# EAGLE schematic ads1298schield (EAGLE 7.2.0)

## Sheet 1 of 4
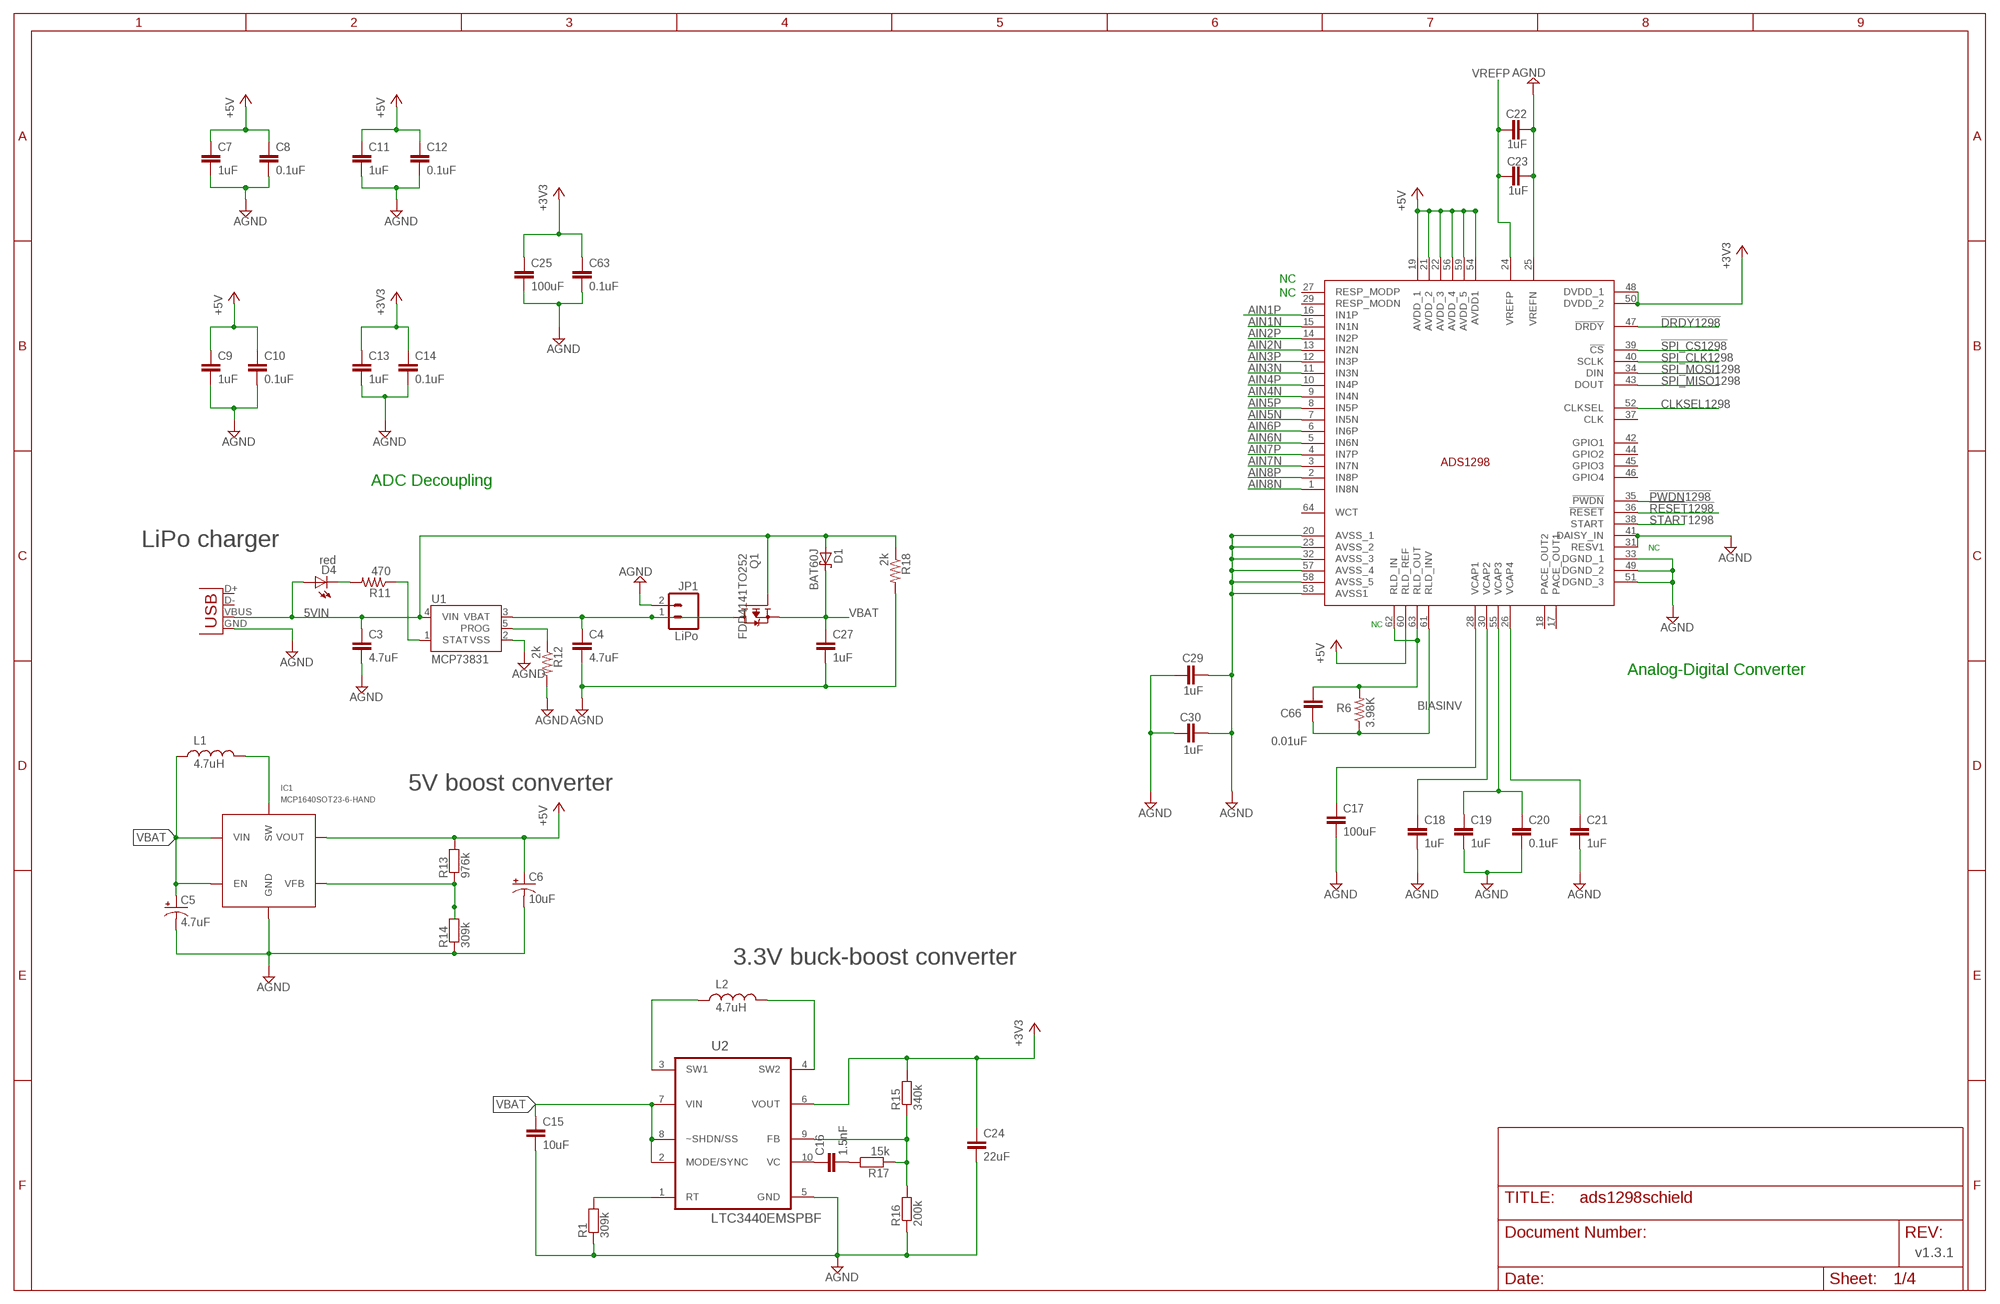
[diagram p0: schematic, sheet 1]

### Parts
C3  4.7uF  CAP0402-CAP  [0402-CAP]
C4  4.7uF  CAP0402-CAP  [0402-CAP]
C5  4.7uF  CAP_POL1206  [EIA3216]
C6  10uF  CAP_POL1206  [EIA3216]
C7  1uF  CAP0603-CAP  [0603-CAP]
C8  0.1uF  CAP0603-CAP  [0603-CAP]
C9  1uF  CAP0603-CAP  [0603-CAP]
C10  0.1uF  CAP0603-CAP  [0603-CAP]
C11  1uF  CAP0603-CAP  [0603-CAP]
C12  0.1uF  CAP0603-CAP  [0603-CAP]
C13  1uF  CAP0603-CAP  [0603-CAP]
C14  0.1uF  CAP0603-CAP  [0603-CAP]
C15  10uF  CAP1210  [1210]
C16  1.5nF  CAP1210  [1210]
C17  100uF  CAP1210  [1210]
C18  1uF  CAP0603-CAP  [0603-CAP]
C19  1uF  CAP0603-CAP  [0603-CAP]
C20  0.1uF  CAP0603-CAP  [0603-CAP]
C21  1uF  CAP0603-CAP  [0603-CAP]
C22  1uF  CAP0603-CAP  [0603-CAP]
C23  1uF  CAP0603-CAP  [0603-CAP]
C24  22uF  CAP1210  [1210]
C25  100uF  CAP1210  [1210]
C27  1uF  CAP0402-CAP  [0402-CAP]
C29  1uF  CAP0603-CAP  [0603-CAP]
C30  1uF  CAP0603-CAP  [0603-CAP]
C63  0.1uF  CAP0603-CAP  [0603-CAP]
C66  0.01uF  CAP0603-CAP  [0603-CAP]
D1  BAT60J  [SOD323_ST]
D4  red  LED0603  [LED-0603]
IC1  MCP1640SOT23-6-HAND  [SOT23-6-HAND]
JP1  LiPo  M02-JST-2MM-SMT  [JST-2-SMD]
L1  4.7uH  INDUCTOR1210-HAND  [1210-HAND]
L2  4.7uH  INDUCTOR1210-HAND  [1210-HAND]
Q1  FDD4141TO252  [TO252]
R1  309k  RESISTOR1206-HAND  [1206-HAND]
R6  3.98K  RESISTOR0603-RES  [0603-RES]
R11  470  RESISTOR0402-RES  [0402-RES]
R12  2k  RESISTOR0402-RES  [0402-RES]
R13  976k  RESISTOR1206-HAND  [1206-HAND]
R14  309k  RESISTOR1206-HAND  [1206-HAND]
R15  340k  RESISTOR1206-HAND  [1206-HAND]
R16  200k  RESISTOR1206-HAND  [1206-HAND]
R17  15k  RESISTOR1206-HAND  [1206-HAND]
R18  2k  RESISTOR0402-RES  [0402-RES]
U1  MCP73831  [SOT23-5]
U2  LTC3440EMSPBF  [SOP50P490X110-10N]
U$2  ADS1298*PAG*  [TQFP64]
X2  USB-MICROB  [USB-MICROB]

### Nets
5VIN: C3.1 D1.A D4.A Q1.1(G) R18.1 U1.4(VIN) X2.VBUS
!DRDY1298: U$2.47(!DRDY) ; also sheet 4
!PWDN1298: U$2.35(!PWDN) ; also sheet 4
!RESET1298: U$2.36(!RESET) ; also sheet 4
!SPI_CS1298: U$2.39(!CS) ; also sheet 4
+3V3: C13.1 C14.1 C24.1 C25.1 C63.1 R15.2 U2.6(VOUT) U$2.48(DVDD_1) U$2.50(DVDD_2) ; also sheet 2,3,4
+5V: C6.A(+) C7.1 C8.1 C9.1 C10.1 C11.1 C12.1 IC1.5(VOUT) R13.2 U$2.19(AVDD_1) U$2.21(AVDD_2) U$2.22(AVDD_3) U$2.54(AVDD1) U$2.56(AVDD_4) U$2.59(AVDD_5) U$2.60(RLD_REF) ; also sheet 2
AGND: C3.2 C4.2 C5.C(-) C6.C(-) C7.2 C8.2 C9.2 C10.2 C11.2 C12.2 C13.2 C14.2 C15.2 C17.2 C18.2 C19.2 C20.2 C21.2 C22.2 C23.2 C24.2 C25.2 C27.2 C29.1 C29.2 C30.1 C30.2 C63.2 IC1.2(GND) JP1.2 R1.1 R12.2 R14.1 R16.1 R18.2 U1.2(VSS) U2.5(GND) U$2.20(AVSS_1) U$2.23(AVSS_2) U$2.25(VREFN) U$2.31(RESV1) U$2.32(AVSS_3) U$2.33(DGND_1) U$2.41(DAISY_IN) U$2.49(DGND_2) U$2.51(DGND_3) U$2.53(AVSS1) U$2.57(AVSS_4) U$2.58(AVSS_5) X2.GND ; also sheet 2,3,4
AIN1N: U$2.15(IN1N) ; also sheet 2
AIN1P: U$2.16(IN1P) ; also sheet 2
AIN2N: U$2.13(IN2N) ; also sheet 2
AIN2P: U$2.14(IN2P) ; also sheet 2
AIN3N: U$2.11(IN3N) ; also sheet 2
AIN3P: U$2.12(IN3P) ; also sheet 2
AIN4N: U$2.9(IN4N) ; also sheet 2
AIN4P: U$2.10(IN4P) ; also sheet 2
AIN5N: U$2.7(IN5N) ; also sheet 2
AIN5P: U$2.8(IN5P) ; also sheet 2
AIN6N: U$2.5(IN6N) ; also sheet 2
AIN6P: U$2.6(IN6P) ; also sheet 2
AIN7N: U$2.3(IN7N) ; also sheet 2
AIN7P: U$2.4(IN7P) ; also sheet 2
AIN8N: U$2.1(IN8N) ; also sheet 2
AIN8P: U$2.2(IN8P) ; also sheet 2
BIASINV: C66.2 R6.1 U$2.61(RLD_INV) ; also sheet 2
CLKSEL1298: U$2.52(CLKSEL) ; also sheet 4
N$3: C17.1 U$2.28(VCAP1)
N$4: C18.1 U$2.30(VCAP2)
N$5: C66.1 R6.2 U$2.62(RLD_IN) U$2.63(RLD_OUT)
N$8: C21.1 U$2.26(VCAP4)
N$13: C19.1 C20.1 U$2.55(VCAP3)
N$16: R12.1 U1.5(PROG)
N$17: R11.1 U1.1(STAT)
N$19: R1.2 U2.1(RT)
N$20: D4.C R11.2
N$21: IC1.1(SW) L1.2
N$23: C5.A(+) IC1.3(EN) IC1.6(VIN) L1.1
N$24: C16.1 U2.10(VC)
N$26: IC1.4(VFB) R13.1 R14.2
N$27: C15.1 U2.2(MODE/SYNC) U2.7(VIN) U2.8(~SHDN/SS)
N$28: L2.1 U2.3(SW1)
N$29: L2.2 U2.4(SW2)
N$31: R15.1 R16.2 R17.1 U2.9(FB)
N$32: C16.2 R17.2
SPI_CLK1298: U$2.40(SCLK) ; also sheet 4
SPI_MISO1298: U$2.43(DOUT) ; also sheet 4
SPI_MOSI1298: U$2.34(DIN) ; also sheet 4
START1298: U$2.38(START) ; also sheet 4
VBAT: C4.1 C27.1 D1.C JP1.1 Q1.2(S) Q1.3(D) U1.3(VBAT) ; also sheet 2
VREFP: C22.1 C23.1 U$2.24(VREFP)
Unconnected: U$2.17(PACE_OUT1) U$2.18(PACE_OUT2) U$2.27(RESP_MODP) U$2.29(RESP_MODN) U$2.37(CLK) U$2.42(GPIO1) U$2.44(GPIO2) U$2.45(GPIO3) U$2.46(GPIO4) U$2.64(WCT) X2.D+ X2.D-

### Notes on the sheet
- NC
- NC
- ADC Decoupling
- LiPo charger
- NC
- NC
- Analog-Digital Converter
- 5V boost converter
- 3.3V buck-boost converter
- v1.3.1

## Sheet 2 of 4
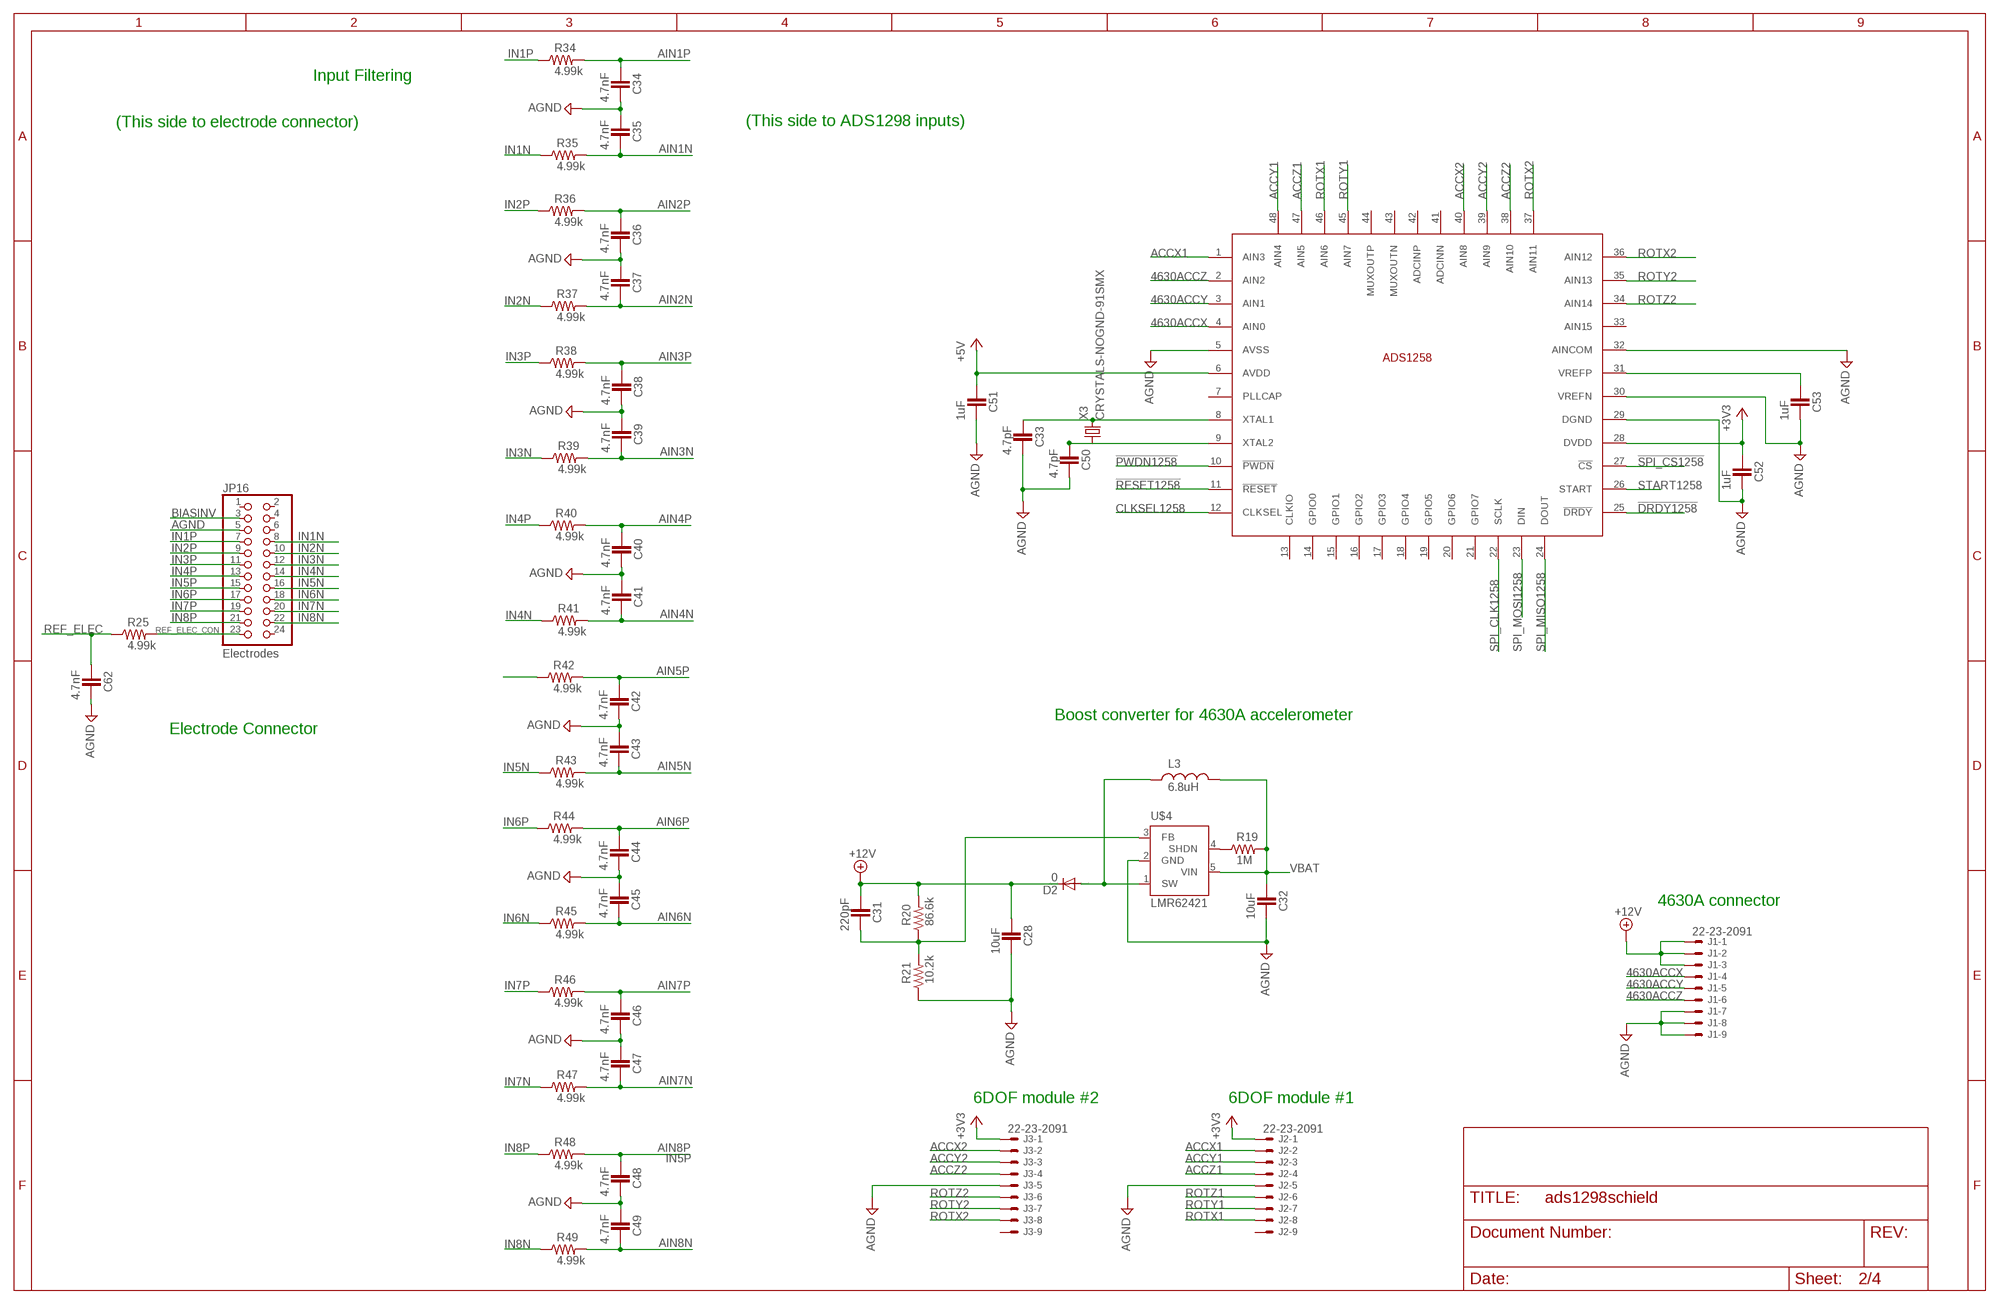
[diagram p1: schematic, sheet 2]

### Parts
C28  10uF  CAP0603-CAP  [0603-CAP]
C31  220pF  CAP0603-CAP  [0603-CAP]
C32  10uF  CAP0603-CAP  [0603-CAP]
C33  4.7pF  CAP0603-CAP  [0603-CAP]
C34  4.7nF  CAP0603-CAP  [0603-CAP]
C35  4.7nF  CAP0603-CAP  [0603-CAP]
C36  4.7nF  CAP0603-CAP  [0603-CAP]
C37  4.7nF  CAP0603-CAP  [0603-CAP]
C38  4.7nF  CAP0603-CAP  [0603-CAP]
C39  4.7nF  CAP0603-CAP  [0603-CAP]
C40  4.7nF  CAP0603-CAP  [0603-CAP]
C41  4.7nF  CAP0603-CAP  [0603-CAP]
C42  4.7nF  CAP0603-CAP  [0603-CAP]
C43  4.7nF  CAP0603-CAP  [0603-CAP]
C44  4.7nF  CAP0603-CAP  [0603-CAP]
C45  4.7nF  CAP0603-CAP  [0603-CAP]
C46  4.7nF  CAP0603-CAP  [0603-CAP]
C47  4.7nF  CAP0603-CAP  [0603-CAP]
C48  4.7nF  CAP0603-CAP  [0603-CAP]
C49  4.7nF  CAP0603-CAP  [0603-CAP]
C50  4.7pF  CAP0603-CAP  [0603-CAP]
C51  1uF  CAP0603-CAP  [0603-CAP]
C52  1uF  CAP0603-CAP  [0603-CAP]
C53  1uF  CAP0603-CAP  [0603-CAP]
C62  4.7nF  CAP0603-CAP  [0603-CAP]
D2  0  DIODE-MELF-MLL41  [MELF-MLL41]
IC2  ADS1258  [P-HVQFN48-7X7]
J1  22-23-2091  [22-23-2091]
J2  22-23-2091  [22-23-2091]
J3  22-23-2091  [22-23-2091]
JP16  Electrodes  PINHD-2X12  [2X12]
L3  6.8uH  INDUCTOR1210-HAND  [1210-HAND]
R19  1M  RESISTOR0603-RES  [0603-RES]
R20  86.6k  RESISTOR0603-RES  [0603-RES]
R21  10.2k  RESISTOR0603-RES  [0603-RES]
R25  4.99k  RESISTOR0603-RES  [0603-RES]
R34  4.99k  RESISTOR0603-RES  [0603-RES]
R35  4.99k  RESISTOR0603-RES  [0603-RES]
R36  4.99k  RESISTOR0603-RES  [0603-RES]
R37  4.99k  RESISTOR0603-RES  [0603-RES]
R38  4.99k  RESISTOR0603-RES  [0603-RES]
R39  4.99k  RESISTOR0603-RES  [0603-RES]
R40  4.99k  RESISTOR0603-RES  [0603-RES]
R41  4.99k  RESISTOR0603-RES  [0603-RES]
R42  4.99k  RESISTOR0603-RES  [0603-RES]
R43  4.99k  RESISTOR0603-RES  [0603-RES]
R44  4.99k  RESISTOR0603-RES  [0603-RES]
R45  4.99k  RESISTOR0603-RES  [0603-RES]
R46  4.99k  RESISTOR0603-RES  [0603-RES]
R47  4.99k  RESISTOR0603-RES  [0603-RES]
R48  4.99k  RESISTOR0603-RES  [0603-RES]
R49  4.99k  RESISTOR0603-RES  [0603-RES]
U$4  LMR62421  [SOT23-5]
X3  CRYSTALS-NOGND-91SMX  [91SMX]

### Nets
4630ACCX: IC2.4(AIN0) J1.4
4630ACCY: IC2.3(AIN1) J1.5
4630ACCZ: IC2.2(AIN2) J1.6
!DRDY1258: IC2.25(!DRDY) ; also sheet 4
!PWDN1258: IC2.10(!PWDN) ; also sheet 4
!RESET1258: IC2.11(!RESET) ; also sheet 4
!SPI_CS1258: IC2.27(!CS) ; also sheet 4
+3V3: C52.1 IC2.28(DVDD) ; also sheet 1,3,4
+5V: C51.1 IC2.6(AVDD) ; also sheet 1
+12V: C28.1 C31.1 D2.C J1.1 J1.2 J1.3 R20.2
ACCX1: IC2.1(AIN3) J2.2
ACCX2: IC2.40(AIN8) J3.2
ACCY1: IC2.48(AIN4) J2.3
ACCY2: IC2.39(AIN9) J3.3
ACCZ1: J2.4
ACCZ2: IC2.38(AIN10) J3.4
AGND: C28.2 C32.2 C33.2 C34.2 C35.1 C36.2 C37.1 C38.2 C39.1 C40.2 C41.1 C42.2 C43.1 C44.2 C45.1 C46.2 C47.1 C48.2 C49.1 C50.2 C51.2 C52.2 C53.2 C62.2 IC2.5(AVSS) IC2.29(DGND) IC2.30(VREFN) IC2.32(AINCOM) J1.7 J1.8 J1.9 J2.5 J3.5 JP16.5 R21.1 U$4.2(GND) ; also sheet 1,3,4
AIN1N: C35.2 R35.2 ; also sheet 1
AIN1P: C34.1 R34.2 ; also sheet 1
AIN2N: C37.2 R37.2 ; also sheet 1
AIN2P: C36.1 R36.2 ; also sheet 1
AIN3N: C39.2 R39.2 ; also sheet 1
AIN3P: C38.1 R38.2 ; also sheet 1
AIN4N: C41.2 R41.2 ; also sheet 1
AIN4P: C40.1 R40.2 ; also sheet 1
AIN5N: C43.2 R43.2 ; also sheet 1
AIN5P: C42.1 R42.2 ; also sheet 1
AIN6N: C45.2 R45.2 ; also sheet 1
AIN6P: C44.1 R44.2 ; also sheet 1
AIN7N: C47.2 R47.2 ; also sheet 1
AIN7P: C46.1 R46.2 ; also sheet 1
AIN8N: C49.2 R49.2 ; also sheet 1
AIN8P: C48.1 R48.2 ; also sheet 1
BIASINV: JP16.3 ; also sheet 1
CLKSEL1258: IC2.12(CLKSEL) ; also sheet 4
IN1N: JP16.8 R35.1
IN1P: JP16.7 R34.1
IN2N: JP16.10 R37.1
IN2P: JP16.9 R36.1
IN3N: JP16.12 R39.1
IN3P: JP16.11 R38.1
IN4N: JP16.14 R41.1
IN4P: JP16.13 R40.1
IN5N: JP16.16 R43.1
IN5P: JP16.15 R42.1
IN6N: JP16.18 R45.1
IN6P: JP16.17 R44.1
IN7N: JP16.20 R47.1
IN7P: JP16.19 R46.1
IN8N: JP16.22 R49.1
IN8P: JP16.21 R48.1
N$7: R19.1 U$4.4(SHDN)
N$12: C33.1 IC2.8(XTAL1) X3.2
N$14: D2.A L3.1 U$4.1(SW)
N$15: C50.1 IC2.9(XTAL2) X3.1
N$18: C31.2 R20.1 R21.2 U$4.3(FB)
N$22: J2.1
N$25: J3.1
N$30: C53.1 IC2.31(VREFP)
REF_ELEC: C62.1 R25.1
REF_ELEC_CON: JP16.23 R25.2
ROTX1: J2.8
ROTX2: IC2.36(AIN12) IC2.37(AIN11) J3.8
ROTY1: J2.7
ROTY2: IC2.35(AIN13) J3.7
ROTZ1: J2.6
ROTZ2: IC2.34(AIN14) J3.6
SPI_CLK1258: IC2.22(SCLK) ; also sheet 4
SPI_MISO1258: IC2.24(DOUT) ; also sheet 4
SPI_MOSI1258: IC2.23(DIN) ; also sheet 4
START1258: IC2.26(START) ; also sheet 4
VBAT: C32.1 L3.2 R19.2 U$4.5(VIN) ; also sheet 1
Unconnected: IC2.7(PLLCAP) IC2.13(CLKIO) IC2.14(GPIO0) IC2.15(GPIO1) IC2.16(GPIO2) IC2.17(GPIO3) IC2.18(GPIO4) IC2.19(GPIO5) IC2.20(GPIO6) IC2.21(GPIO7) IC2.33(AIN15) IC2.41(ADCINN) IC2.42(ADCINP) IC2.43(MUXOUTN) IC2.44(MUXOUTP) IC2.45(AIN7) IC2.46(AIN6) IC2.47(AIN5) J2.9 J3.9 JP16.1 JP16.2 JP16.4 JP16.6 JP16.24

### Notes on the sheet
- Input Filtering
- (This side to electrode connector) | (This side to ADS1298 inputs)
- Boost converter for 4630A accelerometer
- Electrode Connector
- 4630A connector
- 6DOF module #2 | 6DOF module #1

## Sheet 3 of 4: PCB Matrix Packages
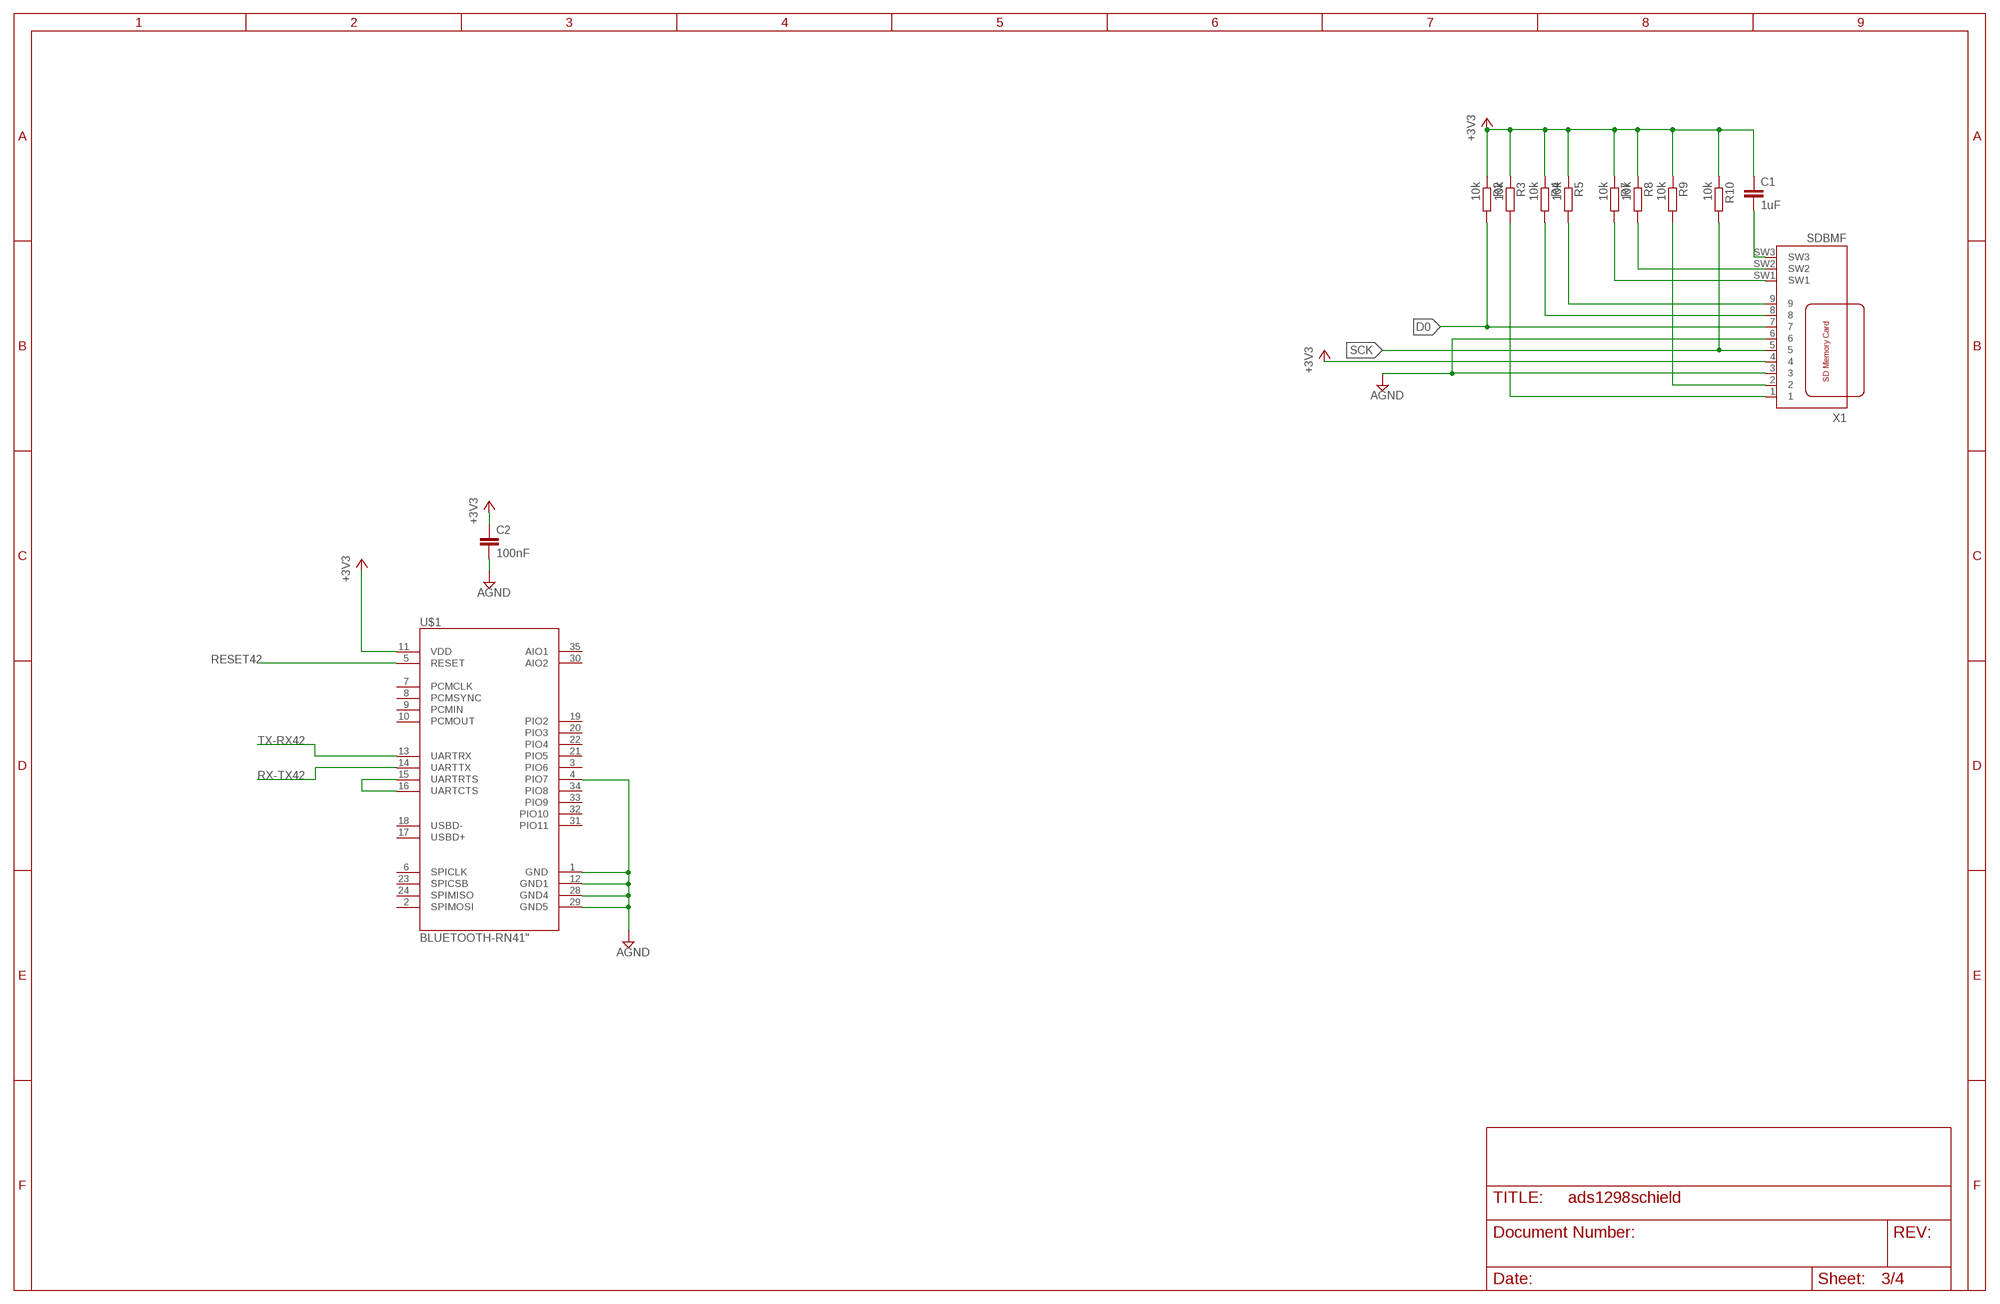
[diagram p2: schematic, sheet 3]

### Parts
C1  1uF  C-EUC1608  [C1608]
C2  100nF  C-EUC0603  [C0603]
R2  10k  R-EU_M1406  [M1406]
R3  10k  R-EU_M1406  [M1406]
R4  10k  R-EU_M1406  [M1406]
R5  10k  R-EU_M1406  [M1406]
R7  10k  R-EU_M1406  [M1406]
R8  10k  R-EU_M1406  [M1406]
R9  10k  R-EU_M1406  [M1406]
R10  10k  R-EU_M1406  [M1406]
U$1  BLUETOOTH-RN41"  [RN41]
X1  SDBMF  [SDBMF-009XXBXX2]

### Nets
+3V3: C1.1 C2.1 R2.1 R3.1 R4.1 R5.1 R7.1 R8.1 R9.1 R10.1 U$1.11(VDD) X1.4 ; also sheet 1,2,4
AGND: C2.2 U$1.1(GND) U$1.4(PIO7) U$1.12(GND1) U$1.28(GND4) U$1.29(GND5) X1.3 X1.6 ; also sheet 1,2,4
CMD: R9.2 X1.2
D0: R2.2 X1.7
LINK: U$1.15(UARTRTS) U$1.16(UARTCTS)
N$1: R3.2 X1.1
N$2: R4.2 X1.8
N$6: R5.2 X1.9
N$9: R7.2 X1.SW1
N$10: R8.2 X1.SW2
N$11: C1.2 X1.SW3
RESET42: U$1.5(RESET) ; also sheet 4
RX-TX42: U$1.14(UARTTX) ; also sheet 4
SCK: R10.2 X1.5
TX-RX42: U$1.13(UARTRX) ; also sheet 4
Unconnected: U$1.2(SPIMOSI) U$1.3(PIO6) U$1.6(SPICLK) U$1.7(PCMCLK) U$1.8(PCMSYNC) U$1.9(PCMIN) U$1.10(PCMOUT) U$1.17(USBD+) U$1.18(USBD-) U$1.19(PIO2) U$1.20(PIO3) U$1.21(PIO5) U$1.22(PIO4) U$1.23(SPICSB) U$1.24(SPIMISO) U$1.30(AIO2) U$1.31(PIO11) U$1.32(PIO10) U$1.33(PIO9) U$1.34(PIO8) U$1.35(AIO1)

## Sheet 4 of 4
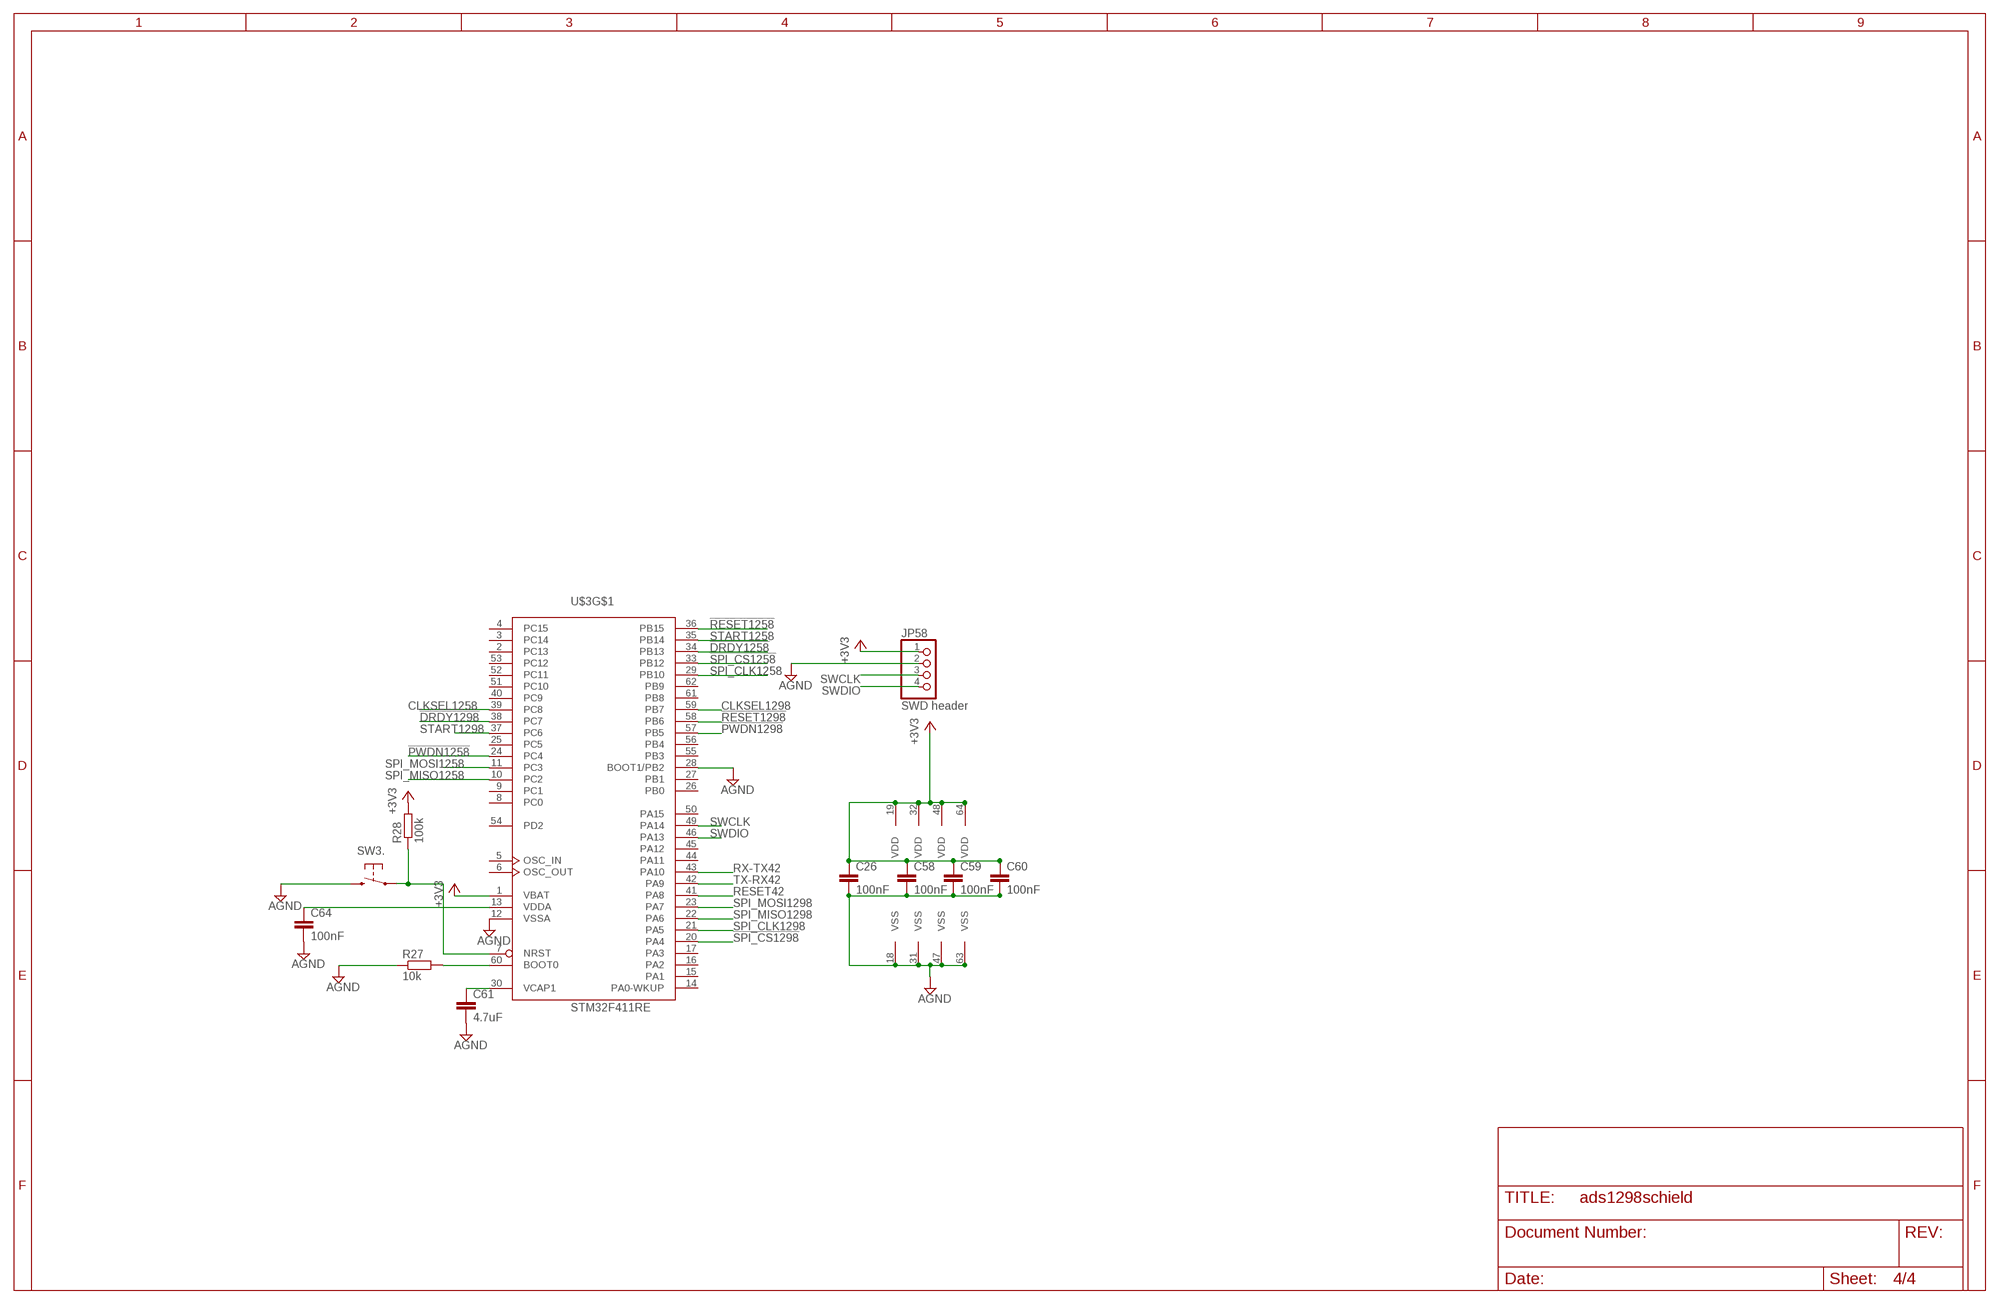
[diagram p3: schematic, sheet 4]

### Parts
C26  100nF  C-EUC1210  [C1210]
C58  100nF  C-EUC1210  [C1210]
C59  100nF  C-EUC1210  [C1210]
C60  100nF  C-EUC1210  [C1210]
C61  4.7uF  C-EUC1210  [C1210]
C64  100nF  C-EUC1210  [C1210]
JP58  SWD header  PINHD-1X4  [1X04]
R27  10k  R-EU_M1406  [M1406]
R28  100k  R-EU_M1406  [M1406]
SW3  !RST  SWITCH-B3U-1110-BOSS  [SWITCH-TACT-B3U-1100P-B]
U$3  STM32F411RE  [LQFP64]

### Nets
!DRDY1258: U$3.34(PB13) ; also sheet 2
!DRDY1298: U$3.38(PC7) ; also sheet 1
!PWDN1258: U$3.24(PC4) ; also sheet 2
!PWDN1298: U$3.57(PB5) ; also sheet 1
!RESET1258: U$3.36(PB15) ; also sheet 2
!RESET1298: U$3.58(PB6) ; also sheet 1
!SPI_CS1258: U$3.33(PB12) ; also sheet 2
!SPI_CS1298: U$3.20(PA4) ; also sheet 1
+3V3: C26.1 C58.1 C59.1 C60.1 JP58.1 R28.2 U$3.1(VBAT) U$3.19(VDD) U$3.32(VDD) U$3.48(VDD) U$3.64(VDD) ; also sheet 1,2,3
AGND: C26.2 C58.2 C59.2 C60.2 C61.2 C64.2 JP58.2 R27.1 SW3.2 U$3.12(VSSA) U$3.18(VSS) U$3.28(BOOT1/PB2) U$3.31(VSS) U$3.47(VSS) U$3.63(VSS) ; also sheet 1,2,3
CLKSEL1258: U$3.39(PC8) ; also sheet 2
CLKSEL1298: U$3.59(PB7) ; also sheet 1
N$87: C61.1 U$3.30(VCAP1)
N$98: R27.2 U$3.60(BOOT0)
N$99: C64.1 U$3.13(VDDA)
N$100: R28.1 SW3.1 U$3.7(NRST)
RESET42: U$3.41(PA8) ; also sheet 3
RX-TX42: U$3.43(PA10) ; also sheet 3
SPI_CLK1258: U$3.29(PB10) ; also sheet 2
SPI_CLK1298: U$3.21(PA5) ; also sheet 1
SPI_MISO1258: U$3.10(PC2) ; also sheet 2
SPI_MISO1298: U$3.22(PA6) ; also sheet 1
SPI_MOSI1258: U$3.11(PC3) ; also sheet 2
SPI_MOSI1298: U$3.23(PA7) ; also sheet 1
START1258: U$3.35(PB14) ; also sheet 2
START1298: U$3.37(PC6) ; also sheet 1
SWCLK: JP58.3 U$3.49(PA14)
SWDIO: JP58.4 U$3.46(PA13)
TX-RX42: U$3.42(PA9) ; also sheet 3
Unconnected: SW3.BOSS U$3.2(PC13) U$3.3(PC14) U$3.4(PC15) U$3.5(OSC_IN) U$3.6(OSC_OUT) U$3.8(PC0) U$3.9(PC1) U$3.14(PA0-WKUP) U$3.15(PA1) U$3.16(PA2) U$3.17(PA3) U$3.25(PC5) U$3.26(PB0) U$3.27(PB1) U$3.40(PC9) U$3.44(PA11) U$3.45(PA12) U$3.50(PA15) U$3.51(PC10) U$3.52(PC11) U$3.53(PC12) U$3.54(PD2) U$3.55(PB3) U$3.56(PB4) U$3.61(PB8) U$3.62(PB9)

## Library data of the parts
C1 C2 C26 C58-C61 C64 = rcl:C-EU: CAPACITOR, European symbol
C3 C4 C27 = SparkFun:CAP: Capacitor Standard 0603 ceramic capacitor, and 0.1" leaded capacitor.
C5 C6 = SteveMarple:CAP_POL: Capacitor Polarized These are standard SMD and PTH capacitors. Normally 10uF, 47uF, and 100uF in electrolytic and tantalum varieties. Always verify the external diameter of the through hole cap, it varies with capacity, voltage, and manufacturer. The EIA devices should be standard.
C7-C25 C28-C53 C62 C63 C66 = SparkFun-Passives:CAP: Capacitor Standard 0603 ceramic capacitor, and 0.1" leaded capacitor.
D1 = diode:BAT60J: Schottky barrier diode Source: www.st.com, BAT60J.pdf
D2 = diode:DIODE-: DIODE
D4 = SparkFun:LED: LEDs Standard schematic elements and footprints for 5mm, 3mm, 1206, and 0603 sized LEDs. 5mm - Spark Fun Electronics SKU : COM-00529 (and others)
IC1 = SteveMarple:MCP1640: MCP1640 0.65V Start-up Synchronous Boost Regulator with True Output Disconnect or Input/Output Bypass Option
IC2 = mfePCB:ADS1258: 16-Channel, 24-Bit Analog-to-Digital Converter
J1-J3 = con-molex:22-23-2091: .100" (2.54mm) Center Header - 9 Pin; MF: MOLEX; MPN: 22-23-2091; OC_FARNELL: 1756827; OC_NEWARK: 56H0450
JP1 = SparkFun:M02: Header 2 Standard 2-pin 0.1" header. Use with straight break away headers (SKU : PRT-00116), right angle break away headers (PRT-00553), swiss pins (PRT-00743), machine pins (PRT-00117), and female headers (PRT-00115). Molex polarized connector foot print use with SKU : PRT-08233 with associated crimp pins and housings.
JP16 = headers:PINHD-2X12: PIN HEADER
JP58 = pinhead:PINHD-1X4: PIN HEADER
L1-L3 = SteveMarple:INDUCTOR: Inductors Basic Inductor/Choke - 0603 and 1206. Footprints are not proven and vary greatly between part numbers.
Q1 = transistor-fet:FDD4141: P-Channel PowerTrench® MOSFET Source: FDD4141.pdf
R1 R13-R17 = SteveMarple:RESISTOR: 1/4W PTH resistor
R2-R5 R7-R10 = rcl:R-EU_: RESISTOR, European symbol
R6 R19-R21 R25 R34-R49 = SparkFun-Passives:RESISTOR: Resistor Basic schematic elements and footprints for 0603, 1206, and PTH resistors.
R11 R12 R18 = SparkFun:RESISTOR: Resistor Basic schematic elements and footprints for 0603, 1206, and PTH resistors.
R27 R28 = resistor:R-EU_: RESISTOR, European symbol
SW3 = stm32f4stamp:SWITCH-B3U-1110
U1 = SparkFun:MCP73831: Microchip's MCP73831 Miniature single cell, fully integrated Li-Ion, Li-polymer charge management controller http://ww1.microchip.com/downloads/en/DeviceDoc/21984a.pdf
U2 = LTC:LTC3440EMSPBF: Micropower Synchronous Buck-Boost DC/DC Converter; MPN: LTC3440EMS#PBF; OC_FARNELL: 1273938; OC_NEWARK: 73K4393; PACKAGE: MSOP-10; SUPPLIER: Linear Technology
U$1 = SparkFun:BLUETOOTH-RN41
U$2 = ADS129x:ADS1298: 8-Channel, 24-Bit Analog-To-Digital Converter With Integrated ECG Front End. Warning: PAG variant (TQFP package) does not have Respiration Module - pins 27 and 29 must stay unconnected! Drawn 23.07.2011 by Tomasz Boleslaw CEDRO (http://www.tomek.cedro.info).
U$3 = micro-stm_v3:STM32F411RE
U$4 = mfePCB:LMR62421: LMR62421 SIMPLE SWITCHER ® 24Vout, 2.1A Step-Up Voltage Regulator in SOT-23; MPN: LMR62421
X1 = farnell:SDBMF: SD MEMORY CARD PUSH-PUSH WITH CONNECTOR TYPE B (BIG SWUÌTCH #3) KINGFONT PRECISION INDUSTIAL CO., LTD Source: http://www.farnell.com/datasheets/74273.pdf Best.-Nr.: 9186174 Hersteller: MULTICOMP Herstellerbez.: SDBMF-00915B0T2
X2 = SparkFun:USB: USB Connectors USB-B-PTH is fully proven SKU : PRT-00139 USB-miniB is fully proven SKU : PRT-00587 USB-A-PCB is untested. USB-A-H is throughly reviewed, but untested. Spark Fun Electronics SKU : PRT-00437 USB-B-SMT is throughly reviewed, but untested. Needs silkscreen touching up. USB-A-S has not been used/tested USB-MB-H has not been used/tested
X3 = IQD-Frequency-Products:CRYSTALS-NOGND: CRYSTALS CAN NOT GROUNDED